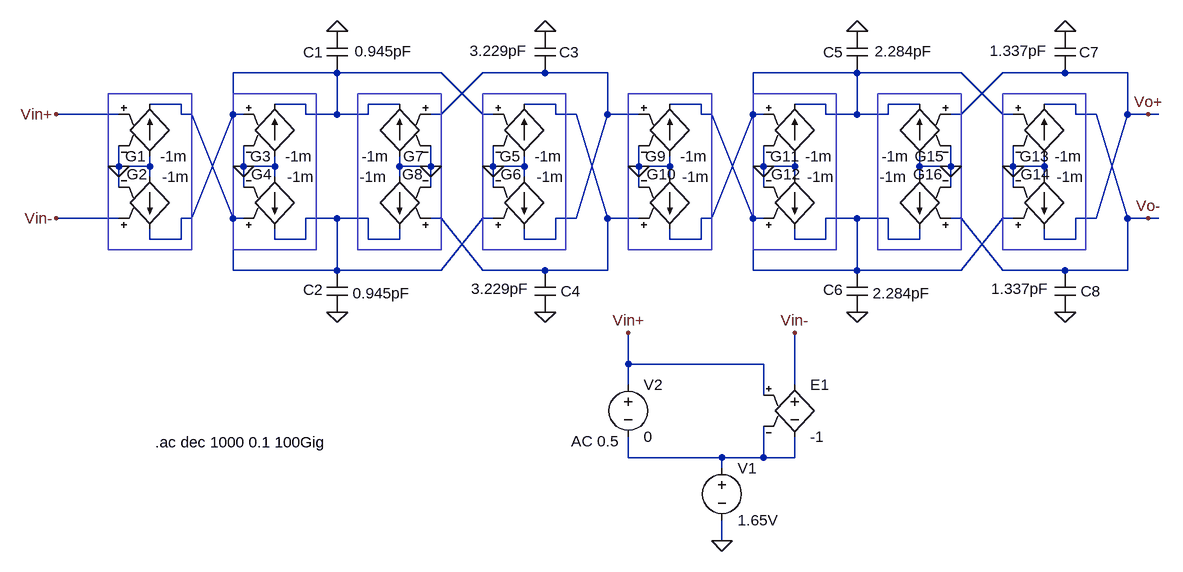
[diagram p0: schematic AFProject_Macromodel_Fully_Differential.asc]
AFProject_Macromodel_Fully_Differential.asc, the LTspice schematic file:
Version 4
SHEET 1 1448 884
WIRE 160 144 0 144
WIRE 320 144 160 144
WIRE 480 144 384 144
WIRE 576 144 480 144
WIRE 960 144 800 144
WIRE 1120 144 960 144
WIRE 1280 144 1184 144
WIRE 1376 144 1280 144
WIRE -80 192 -128 192
WIRE 112 192 64 192
WIRE 256 192 208 192
WIRE 496 192 448 192
WIRE 720 192 672 192
WIRE 912 192 864 192
WIRE 1056 192 1008 192
WIRE 1296 192 1248 192
WIRE -176 208 -272 208
WIRE -80 208 -80 192
WIRE -64 208 -80 208
WIRE 0 208 0 144
WIRE 16 208 0 208
WIRE 112 208 112 192
WIRE 160 208 160 144
WIRE 160 208 112 208
WIRE 208 208 208 192
WIRE 208 208 160 208
WIRE 320 208 384 144
WIRE 320 208 304 208
WIRE 384 208 320 144
WIRE 400 208 384 208
WIRE 496 208 496 192
WIRE 528 208 496 208
WIRE 576 208 576 144
WIRE 624 208 576 208
WIRE 720 208 720 192
WIRE 736 208 720 208
WIRE 800 208 800 144
WIRE 816 208 800 208
WIRE 912 208 912 192
WIRE 960 208 960 144
WIRE 960 208 912 208
WIRE 1008 208 1008 192
WIRE 1008 208 960 208
WIRE 1120 208 1184 144
WIRE 1120 208 1104 208
WIRE 1184 208 1120 144
WIRE 1200 208 1184 208
WIRE 1296 208 1296 192
WIRE 1328 208 1296 208
WIRE 1376 208 1376 144
WIRE 1408 208 1376 208
WIRE 1424 208 1408 208
WIRE -176 288 -176 256
WIRE -128 288 -128 272
WIRE -128 288 -176 288
WIRE 16 288 16 256
WIRE 64 288 64 272
WIRE 64 288 16 288
WIRE 256 288 256 272
WIRE 304 288 304 256
WIRE 304 288 256 288
WIRE 400 288 400 256
WIRE 448 288 448 272
WIRE 448 288 400 288
WIRE 624 288 624 256
WIRE 672 288 672 272
WIRE 672 288 624 288
WIRE 816 288 816 256
WIRE 864 288 864 272
WIRE 864 288 816 288
WIRE 1056 288 1056 272
WIRE 1104 288 1104 256
WIRE 1104 288 1056 288
WIRE 1200 288 1200 256
WIRE 1248 288 1248 272
WIRE 1248 288 1200 288
WIRE -128 304 -128 288
WIRE 64 304 64 288
WIRE 256 304 256 288
WIRE 448 304 448 288
WIRE 672 304 672 288
WIRE 864 304 864 288
WIRE 1056 304 1056 288
WIRE 1248 304 1248 288
WIRE -176 320 -176 288
WIRE 16 320 16 288
WIRE 304 320 304 288
WIRE 400 320 400 288
WIRE 624 320 624 288
WIRE 816 320 816 288
WIRE 1104 320 1104 288
WIRE 1200 320 1200 288
WIRE -176 368 -272 368
WIRE -64 368 0 208
WIRE -64 368 -80 368
WIRE 0 368 -64 208
WIRE 16 368 0 368
WIRE 160 368 112 368
WIRE 208 368 160 368
WIRE 320 368 304 368
WIRE 400 368 384 368
WIRE 528 368 576 208
WIRE 528 368 496 368
WIRE 576 368 528 208
WIRE 624 368 576 368
WIRE 736 368 800 208
WIRE 736 368 720 368
WIRE 800 368 736 208
WIRE 816 368 800 368
WIRE 960 368 912 368
WIRE 1008 368 960 368
WIRE 1120 368 1104 368
WIRE 1200 368 1184 368
WIRE 1328 368 1376 208
WIRE 1328 368 1296 368
WIRE 1376 368 1328 208
WIRE 1408 368 1376 368
WIRE 1424 368 1408 368
WIRE -128 400 -128 384
WIRE -80 400 -80 368
WIRE -80 400 -128 400
WIRE 64 400 64 384
WIRE 112 400 112 368
WIRE 112 400 64 400
WIRE 208 400 208 368
WIRE 256 400 256 384
WIRE 256 400 208 400
WIRE 448 400 448 384
WIRE 496 400 496 368
WIRE 496 400 448 400
WIRE 672 400 672 384
WIRE 720 400 720 368
WIRE 720 400 672 400
WIRE 864 400 864 384
WIRE 912 400 912 368
WIRE 912 400 864 400
WIRE 1008 400 1008 368
WIRE 1056 400 1056 384
WIRE 1056 400 1008 400
WIRE 1248 400 1248 384
WIRE 1296 400 1296 368
WIRE 1296 400 1248 400
WIRE 0 448 0 368
WIRE 160 448 160 368
WIRE 160 448 0 448
WIRE 320 448 384 368
WIRE 320 448 160 448
WIRE 384 448 320 368
WIRE 480 448 384 448
WIRE 576 448 576 368
WIRE 576 448 480 448
WIRE 800 448 800 368
WIRE 960 448 960 368
WIRE 960 448 800 448
WIRE 1120 448 1184 368
WIRE 1120 448 960 448
WIRE 1184 448 1120 368
WIRE 1280 448 1184 448
WIRE 1376 448 1376 368
WIRE 1376 448 1280 448
WIRE 608 592 608 544
WIRE 816 592 608 592
WIRE 608 624 608 592
WIRE 864 624 864 544
WIRE 816 640 816 592
WIRE 608 736 608 704
WIRE 752 736 608 736
WIRE 816 736 816 688
WIRE 816 736 752 736
WIRE 864 736 864 704
WIRE 864 736 816 736
WIRE 752 752 752 736
WIRE 752 864 752 832
FLAG -176 288 0
FLAG 16 288 0
FLAG 400 288 0
FLAG 304 288 0
FLAG 160 512 0
FLAG 480 512 0
FLAG 160 80 0
FLAG 480 80 0
FLAG 624 288 0
FLAG 816 288 0
FLAG 1200 288 0
FLAG 1104 288 0
FLAG 960 512 0
FLAG 1280 512 0
FLAG 960 80 0
FLAG 1280 80 0
FLAG 1408 208 Vo+
FLAG 1408 368 Vo-
FLAG -272 208 Vin+
FLAG -272 368 Vin-
FLAG 752 864 0
FLAG 608 544 Vin+
FLAG 864 544 Vin-
SYMBOL g -128 176 R0
WINDOW 0 -38 96 Left 2
WINDOW 3 16 96 Left 2
SYMATTR InstName G1
SYMATTR Value -1m
SYMBOL g -128 400 M180
WINDOW 0 -36 100 Left 2
WINDOW 3 19 96 Left 2
SYMATTR InstName G2
SYMATTR Value -1m
SYMBOL g 64 176 R0
WINDOW 0 -38 96 Left 2
WINDOW 3 16 96 Left 2
SYMATTR InstName G3
SYMATTR Value -1m
SYMBOL g 64 400 M180
WINDOW 0 -36 100 Left 2
WINDOW 3 19 96 Left 2
SYMATTR InstName G4
SYMATTR Value -1m
SYMBOL g 448 176 R0
WINDOW 0 -38 96 Left 2
WINDOW 3 16 96 Left 2
SYMATTR InstName G5
SYMATTR Value -1m
SYMBOL g 448 400 M180
WINDOW 0 -36 100 Left 2
WINDOW 3 19 96 Left 2
SYMATTR InstName G6
SYMATTR Value -1m
SYMBOL g 256 176 M0
WINDOW 0 -38 96 Left 2
WINDOW 3 16 96 Left 2
SYMATTR InstName G7
SYMATTR Value -1m
SYMBOL g 256 400 R180
WINDOW 0 -36 100 Left 2
WINDOW 3 19 96 Left 2
SYMATTR InstName G8
SYMATTR Value -1m
SYMBOL cap 144 80 R0
WINDOW 0 -36 32 Left 2
WINDOW 3 43 31 Left 2
SYMATTR InstName C1
SYMATTR Value 0.945pF
SYMBOL cap 144 448 R0
WINDOW 0 -36 30 Left 2
WINDOW 3 40 35 Left 2
SYMATTR InstName C2
SYMATTR Value 0.945pF
SYMBOL cap 464 80 R0
WINDOW 0 38 32 Left 2
WINDOW 3 -100 30 Left 2
SYMATTR InstName C3
SYMATTR Value 3.229pF
SYMBOL cap 464 448 R0
WINDOW 0 40 32 Left 2
WINDOW 3 -98 28 Left 2
SYMATTR InstName C4
SYMATTR Value 3.229pF
SYMBOL g 672 176 R0
WINDOW 0 -38 96 Left 2
WINDOW 3 16 96 Left 2
SYMATTR InstName G9
SYMATTR Value -1m
SYMBOL g 672 400 M180
WINDOW 0 -36 100 Left 2
WINDOW 3 19 96 Left 2
SYMATTR InstName G10
SYMATTR Value -1m
SYMBOL g 864 176 R0
WINDOW 0 -38 96 Left 2
WINDOW 3 16 96 Left 2
SYMATTR InstName G11
SYMATTR Value -1m
SYMBOL g 864 400 M180
WINDOW 0 -36 100 Left 2
WINDOW 3 19 96 Left 2
SYMATTR InstName G12
SYMATTR Value -1m
SYMBOL g 1248 176 R0
WINDOW 0 -38 96 Left 2
WINDOW 3 16 96 Left 2
SYMATTR InstName G13
SYMATTR Value -1m
SYMBOL g 1248 400 M180
WINDOW 0 -36 100 Left 2
WINDOW 3 19 96 Left 2
SYMATTR InstName G14
SYMATTR Value -1m
SYMBOL g 1056 176 M0
WINDOW 0 -38 96 Left 2
WINDOW 3 16 96 Left 2
SYMATTR InstName G15
SYMATTR Value -1m
SYMBOL g 1056 400 R180
WINDOW 0 -36 100 Left 2
WINDOW 3 19 96 Left 2
SYMATTR InstName G16
SYMATTR Value -1m
SYMBOL cap 944 80 R0
WINDOW 0 -36 32 Left 2
WINDOW 3 43 31 Left 2
SYMATTR InstName C5
SYMATTR Value 2.284pF
SYMBOL cap 944 448 R0
WINDOW 0 -36 30 Left 2
WINDOW 3 40 35 Left 2
SYMATTR InstName C6
SYMATTR Value 2.284pF
SYMBOL cap 1264 80 R0
WINDOW 0 38 32 Left 2
WINDOW 3 -100 30 Left 2
SYMATTR InstName C7
SYMATTR Value 1.337pF
SYMBOL cap 1264 448 R0
WINDOW 0 40 32 Left 2
WINDOW 3 -98 28 Left 2
SYMATTR InstName C8
SYMATTR Value 1.337pF
SYMBOL voltage 608 608 R0
WINDOW 123 -88 103 Left 2
WINDOW 39 0 0 Left 0
SYMATTR InstName V2
SYMATTR Value 0
SYMATTR Value2 AC 0.5
SYMBOL voltage 752 736 R0
WINDOW 123 0 0 Left 0
WINDOW 39 0 0 Left 0
SYMATTR InstName V1
SYMATTR Value 1.65V
SYMBOL e 864 608 R0
SYMATTR InstName E1
SYMATTR Value -1
TEXT -120 712 Left 2 !.ac dec 1000 0.1 100Gig
LINE Normal -192 176 -192 416
LINE Normal -64 176 -192 176
LINE Normal -64 416 -64 176
LINE Normal -192 416 -64 416
LINE Normal 0 176 0 416
LINE Normal 128 176 0 176
LINE Normal 128 416 128 176
LINE Normal 0 416 128 416
LINE Normal 384 176 384 416
LINE Normal 512 176 384 176
LINE Normal 512 416 512 176
LINE Normal 384 416 512 416
LINE Normal 320 176 320 416
LINE Normal 192 176 320 176
LINE Normal 192 416 192 176
LINE Normal 320 416 192 416
LINE Normal 608 176 608 416
LINE Normal 736 176 608 176
LINE Normal 736 416 736 176
LINE Normal 608 416 736 416
LINE Normal 800 176 800 416
LINE Normal 928 176 800 176
LINE Normal 928 416 928 176
LINE Normal 800 416 928 416
LINE Normal 1184 176 1184 416
LINE Normal 1312 176 1184 176
LINE Normal 1312 416 1312 176
LINE Normal 1184 416 1312 416
LINE Normal 1120 176 1120 416
LINE Normal 992 176 1120 176
LINE Normal 992 416 992 176
LINE Normal 1120 416 992 416

The netlist it stands for:
* AFProject_Macromodel_Fully_Differential.asc
G1 0 N004 Vin+ 0 -1m
G2 0 N001 Vin- 0 -1m
G3 0 N001 N001 0 -1m
G4 0 N004 N004 0 -1m
G5 0 N005 N001 0 -1m
G6 0 N002 N004 0 -1m
G7 0 N001 N002 0 -1m
G8 0 N004 N005 0 -1m
C1 0 N001 0.945pF
C2 N004 0 0.945pF
C3 0 N002 3.229pF
C4 N005 0 3.229pF
G9 0 N006 N002 0 -1m
G10 0 N003 N005 0 -1m
G11 0 N003 N003 0 -1m
G12 0 N006 N006 0 -1m
G13 0 Vo- N003 0 -1m
G14 0 Vo+ N006 0 -1m
G15 0 N003 Vo+ 0 -1m
G16 0 N006 Vo- 0 -1m
C5 0 N003 2.284pF
C6 N006 0 2.284pF
C7 0 Vo+ 1.337pF
C8 Vo- 0 1.337pF
V2 Vin+ N007 0 AC 0.5
V1 N007 0 1.65V
E1 Vin- N007 Vin+ N007 -1
.ac dec 1000 0.1 100Gig
.backanno
.end